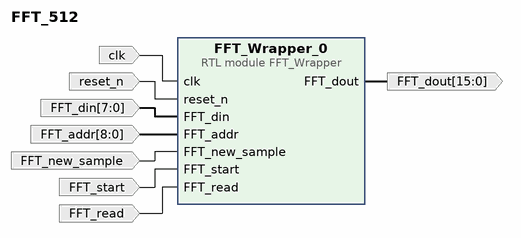
[diagram p0: block diagram of the top level]
# Vivado block design FFT_512, xc7s50csga324-1, Vivado 2018.3
create_bd_design FFT_512

create_bd_port -dir I -type clk clk
set_property -dict {CONFIG.FREQ_HZ 108000000} [get_bd_ports clk]
create_bd_port -dir I -type rst reset_n
create_bd_port -dir I -from 7 -to 0 FFT_din
create_bd_port -dir I -from 8 -to 0 FFT_addr
create_bd_port -dir I FFT_new_sample
create_bd_port -dir I FFT_start
create_bd_port -dir I FFT_read
create_bd_port -dir O -from 15 -to 0 FFT_dout

create_bd_cell -type module -reference FFT_Wrapper FFT_Wrapper_0

# ---- connections ----

connect_bd_net [get_bd_ports clk] [get_bd_pins FFT_Wrapper_0/clk]
connect_bd_net [get_bd_ports reset_n] [get_bd_pins FFT_Wrapper_0/reset_n]
connect_bd_net [get_bd_ports FFT_din] [get_bd_pins FFT_Wrapper_0/FFT_din]
connect_bd_net [get_bd_ports FFT_addr] [get_bd_pins FFT_Wrapper_0/FFT_addr]
connect_bd_net [get_bd_ports FFT_new_sample] [get_bd_pins FFT_Wrapper_0/FFT_new_sample]
connect_bd_net [get_bd_ports FFT_start] [get_bd_pins FFT_Wrapper_0/FFT_start]
connect_bd_net [get_bd_ports FFT_read] [get_bd_pins FFT_Wrapper_0/FFT_read]
connect_bd_net [get_bd_pins FFT_Wrapper_0/FFT_dout] [get_bd_ports FFT_dout]

validate_bd_design
save_bd_design
